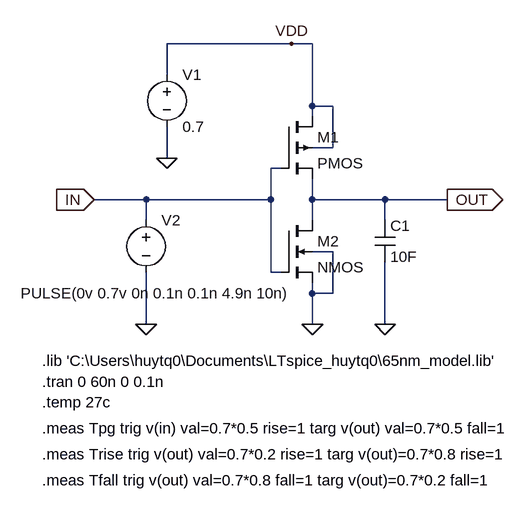
[diagram p0: schematic Inverter.asc]
Inverter.asc, the LTspice schematic file:
Version 4
SHEET 1 880 680
WIRE 144 -80 -48 -80
WIRE 176 -80 144 -80
WIRE -48 -32 -48 -80
WIRE 176 16 176 -80
WIRE 208 16 176 16
WIRE 176 32 176 16
WIRE 208 80 208 16
WIRE 208 80 176 80
WIRE -48 96 -48 48
WIRE 128 112 112 112
WIRE -80 160 -160 160
WIRE 112 160 112 112
WIRE 112 160 -80 160
WIRE 176 160 176 128
WIRE 288 160 176 160
WIRE 384 160 288 160
WIRE -80 192 -80 160
WIRE 176 192 176 160
WIRE 288 192 288 160
WIRE 208 240 176 240
WIRE 112 272 112 160
WIRE 128 272 112 272
WIRE 176 304 176 288
WIRE 208 304 208 240
WIRE 208 304 176 304
WIRE -80 352 -80 272
WIRE 176 352 176 304
WIRE 288 352 288 256
FLAG 176 352 0
FLAG 288 352 0
FLAG -80 352 0
FLAG -48 96 0
FLAG -160 160 IN
IOPIN -160 160 In
FLAG 384 160 OUT
IOPIN 384 160 Out
FLAG 144 -80 VDD
SYMBOL pmos4 128 32 R0
SYMATTR InstName M1
SYMATTR Value2 l=65n w=2u
SYMBOL nmos4 128 192 R0
SYMATTR InstName M2
SYMATTR Value2 l=65n w=2u
SYMBOL voltage -48 -48 R0
WINDOW 123 0 0 Left 0
WINDOW 39 0 0 Left 0
SYMATTR InstName V1
SYMATTR Value 0.7
SYMBOL voltage -80 176 R0
WINDOW 3 -193 128 Left 2
WINDOW 123 0 0 Left 0
WINDOW 39 0 0 Left 0
SYMATTR InstName V2
SYMATTR Value PULSE(0v 0.7v 0n 0.1n 0.1n 4.9n 10n)
SYMBOL cap 272 192 R0
SYMATTR InstName C1
SYMATTR Value 10F
TEXT -240 440 Left 2 !.tran 0 60n 0 0.1n
TEXT -240 472 Left 2 !.temp 27c
TEXT -240 408 Left 2 !.lib 'C:\\Users\\huytq0\\Documents\\LTspice_huytq0\\65nm_model.lib'
TEXT -240 512 Left 2 !.meas Tpg trig v(in) val=0.7*0.5 rise=1 targ v(out) val=0.7*0.5 fall=1
TEXT -240 552 Left 2 !.meas Trise trig v(out) val=0.7*0.2 rise=1 targ v(out)=0.7*0.8 rise=1
TEXT -240 592 Left 2 !.meas Tfall trig v(out) val=0.7*0.8 fall=1 targ v(out)=0.7*0.2 fall=1

The netlist it stands for:
* Inverter.asc
M1 VDD IN OUT VDD PMOS l=65n w=2u
M2 OUT IN 0 0 NMOS l=65n w=2u
V1 VDD 0 0.7
V2 IN 0 PULSE(0v 0.7v 0n 0.1n 0.1n 4.9n 10n)
C1 OUT 0 10F
.model NMOS NMOS
.model PMOS PMOS
.lib standard.mos
.tran 0 60n 0 0.1n
.temp 27c
.lib 'C:\Users\huytq0\Documents\LTspice_huytq0\65nm_model.lib'
.meas Tpg trig v(in) val=0.7*0.5 rise=1 targ v(out) val=0.7*0.5 fall=1
.meas Trise trig v(out) val=0.7*0.2 rise=1 targ v(out)=0.7*0.8 rise=1
.meas Tfall trig v(out) val=0.7*0.8 fall=1 targ v(out)=0.7*0.2 fall=1
.backanno
.end

* Results of the author's LTspice run, read from the files saved beside the schematic
* Operating Point, zero values left out:
*   V(vdd) = 700 mV
*   V(out) = 700 mV
*   Id(M2) = 37.56 nA
*   Ig(M2) = -704.8 pA
*   Is(M2) = -36.86 nA
*   Id(M1) = 37.48 nA
*   Ig(M1) = -15.71 pA
*   Is(M1) = -37.46 nA
*   I(V2) = 720.5 pA
*   I(V1) = -37.58 nA